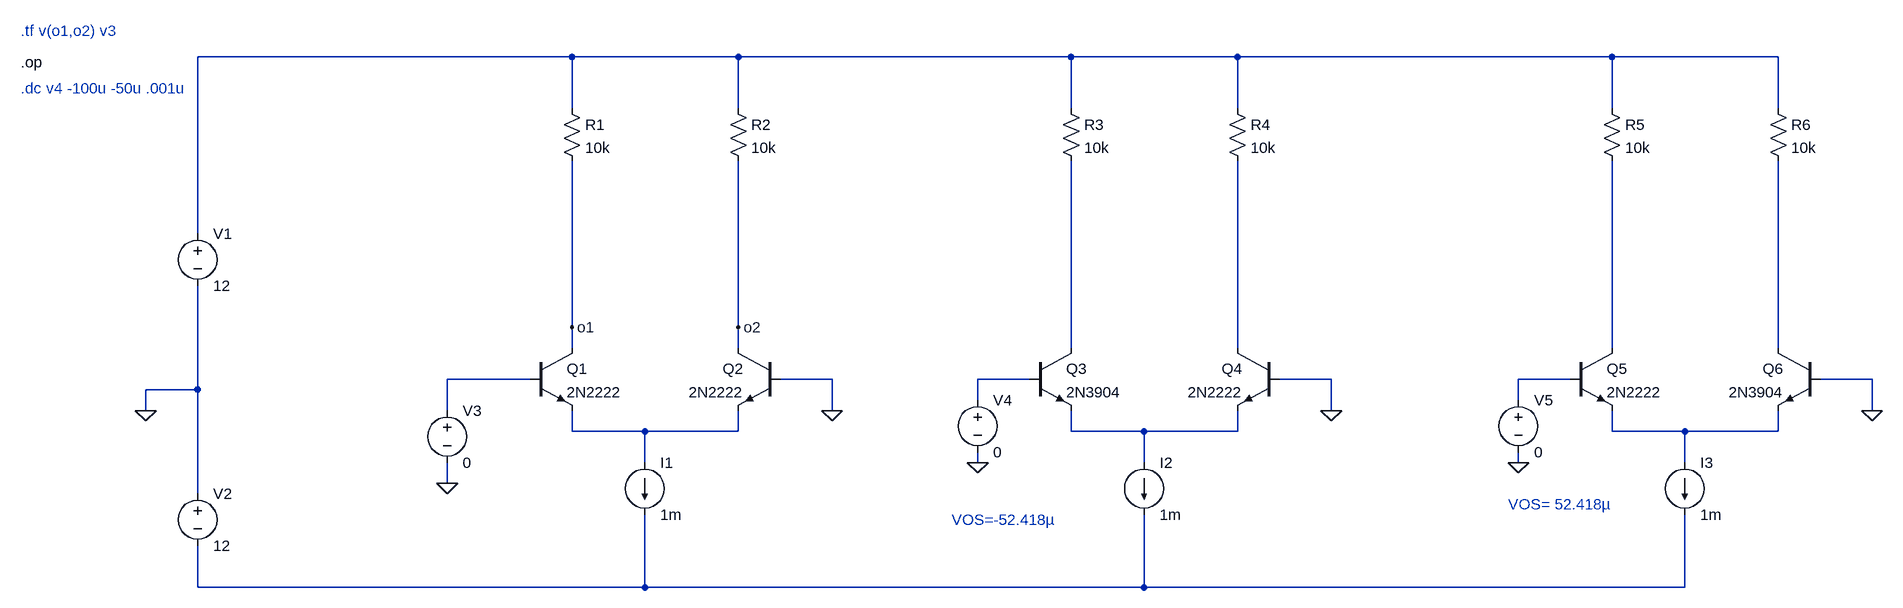
[diagram p0: schematic diferencial1.asc]
diferencial1.asc, the LTspice schematic file:
Version 4
SHEET 1 2196 680
WIRE 176 -320 -400 -320
WIRE 432 -320 176 -320
WIRE 944 -320 432 -320
WIRE 1200 -320 944 -320
WIRE 1776 -320 1200 -320
WIRE 2032 -320 1776 -320
WIRE 176 -240 176 -320
WIRE 432 -240 432 -320
WIRE 944 -240 944 -320
WIRE 1200 -240 1200 -320
WIRE 1776 -240 1776 -320
WIRE 2032 -240 2032 -320
WIRE -400 -48 -400 -320
WIRE 176 96 176 -160
WIRE 432 96 432 -160
WIRE 176 128 176 96
WIRE 432 128 432 96
WIRE 944 128 944 -160
WIRE 1200 128 1200 -160
WIRE 1776 128 1776 -160
WIRE 2032 128 2032 -160
WIRE 112 176 -16 176
WIRE 576 176 496 176
WIRE 880 176 800 176
WIRE 1344 176 1264 176
WIRE 1712 176 1632 176
WIRE 2176 176 2096 176
WIRE -400 192 -400 32
WIRE -400 192 -480 192
WIRE 800 208 800 176
WIRE 1632 208 1632 176
WIRE -480 224 -480 192
WIRE -16 224 -16 176
WIRE 576 224 576 176
WIRE 1344 224 1344 176
WIRE 2176 224 2176 176
WIRE 176 256 176 224
WIRE 288 256 176 256
WIRE 432 256 432 224
WIRE 432 256 288 256
WIRE 944 256 944 224
WIRE 1056 256 944 256
WIRE 1200 256 1200 224
WIRE 1200 256 1056 256
WIRE 1776 256 1776 224
WIRE 1888 256 1776 256
WIRE 2032 256 2032 224
WIRE 2032 256 1888 256
WIRE 288 304 288 256
WIRE 800 304 800 288
WIRE 1056 304 1056 256
WIRE 1632 304 1632 288
WIRE 1888 304 1888 256
WIRE -16 336 -16 304
WIRE -400 352 -400 192
WIRE -400 496 -400 432
WIRE 288 496 288 384
WIRE 288 496 -400 496
WIRE 1056 496 1056 384
WIRE 1056 496 288 496
WIRE 1888 496 1888 384
WIRE 1888 496 1056 496
FLAG -480 224 0
FLAG 576 224 0
FLAG -16 336 0
FLAG 176 96 o1
FLAG 432 96 o2
FLAG 1344 224 0
FLAG 800 304 0
FLAG 2176 224 0
FLAG 1632 304 0
DATAFLAG 288 256 ""
DATAFLAG 176 -32 ""
DATAFLAG 432 -48 ""
DATAFLAG 1056 256 ""
DATAFLAG 944 -32 ""
DATAFLAG 1200 -48 ""
DATAFLAG 1888 256 ""
DATAFLAG 1776 -32 ""
DATAFLAG 2032 -48 ""
SYMBOL npn 112 128 R0
SYMATTR InstName Q1
SYMATTR Value 2N2222
SYMBOL npn 496 128 M0
SYMATTR InstName Q2
SYMATTR Value 2N2222
SYMBOL current 288 304 R0
WINDOW 123 0 0 Left 0
WINDOW 39 0 0 Left 0
SYMATTR InstName I1
SYMATTR Value 1m
SYMBOL res 160 -256 R0
SYMATTR InstName R1
SYMATTR Value 10k
SYMBOL res 416 -256 R0
SYMATTR InstName R2
SYMATTR Value 10k
SYMBOL voltage -400 -64 R0
WINDOW 123 0 0 Left 0
WINDOW 39 0 0 Left 0
SYMATTR InstName V1
SYMATTR Value 12
SYMBOL voltage -400 336 R0
WINDOW 123 0 0 Left 0
WINDOW 39 0 0 Left 0
SYMATTR InstName V2
SYMATTR Value 12
SYMBOL voltage -16 208 R0
WINDOW 123 0 0 Left 0
WINDOW 39 0 0 Left 0
SYMATTR InstName V3
SYMATTR Value 0
SYMBOL npn 880 128 R0
SYMATTR InstName Q3
SYMATTR Value 2N3904
SYMBOL npn 1264 128 M0
SYMATTR InstName Q4
SYMATTR Value 2N2222
SYMBOL current 1056 304 R0
WINDOW 123 0 0 Left 0
WINDOW 39 0 0 Left 0
SYMATTR InstName I2
SYMATTR Value 1m
SYMBOL res 928 -256 R0
SYMATTR InstName R3
SYMATTR Value 10k
SYMBOL res 1184 -256 R0
SYMATTR InstName R4
SYMATTR Value 10k
SYMBOL voltage 800 192 R0
WINDOW 123 0 0 Left 0
WINDOW 39 0 0 Left 0
SYMATTR InstName V4
SYMATTR Value 0
SYMBOL npn 1712 128 R0
SYMATTR InstName Q5
SYMATTR Value 2N2222
SYMBOL npn 2096 128 M0
SYMATTR InstName Q6
SYMATTR Value 2N3904
SYMBOL current 1888 304 R0
WINDOW 123 0 0 Left 0
WINDOW 39 0 0 Left 0
SYMATTR InstName I3
SYMATTR Value 1m
SYMBOL res 1760 -256 R0
SYMATTR InstName R5
SYMATTR Value 10k
SYMBOL res 2016 -256 R0
SYMATTR InstName R6
SYMATTR Value 10k
SYMBOL voltage 1632 192 R0
WINDOW 123 0 0 Left 0
WINDOW 39 0 0 Left 0
SYMATTR InstName V5
SYMATTR Value 0
TEXT -672 -312 Left 2 !.op
TEXT -672 -272 Left 2 ;.dc v4 -100u -50u .001u
TEXT -672 -360 Left 2 ;.tf v(o1,o2) v3
TEXT 760 392 Left 2 ;VOS=-52.418µ
TEXT 1616 368 Left 2 ;VOS= 52.418µ

The netlist it stands for:
* diferencial1.asc
Q1 o1 N006 N009 0 2N2222
Q2 o2 0 N009 0 2N2222
I1 N009 N012 1m
R1 N001 o1 10k
R2 N001 o2 10k
V1 N001 0 12
V2 0 N012 12
V3 N006 0 0
Q3 N002 N007 N010 0 2N3904
Q4 N003 0 N010 0 2N2222
I2 N010 N012 1m
R3 N001 N002 10k
R4 N001 N003 10k
V4 N007 0 0
Q5 N004 N008 N011 0 2N2222
Q6 N005 0 N011 0 2N3904
I3 N011 N012 1m
R5 N001 N004 10k
R6 N001 N005 10k
V5 N008 0 0
.model NPN NPN
.model PNP PNP
.lib standard.bjt
.op
* .dc v4 -100u -50u .001u
* .tf v(o1,o2) v3
* VOS=-52.418µ
* VOS= 52.418µ
.backanno
.end